# Altium schematic sheet Sheet4.SchDoc
size A4
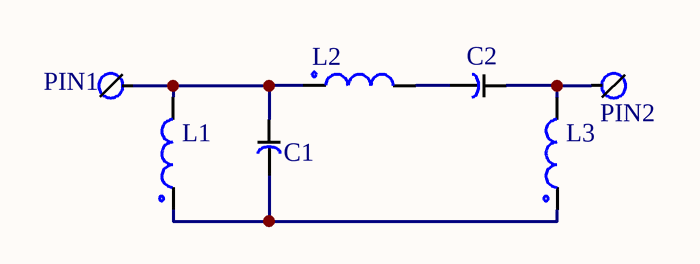
[diagram p0: Sheet4.SchDoc]

## Parts
C1  C1,C3  [C1,C3]  (value not drawn)
C2  C2  [C2]  (value not drawn)
L1  L1,L2,L3  [L1,L2,L3]  (value not drawn)
L2  L1,L2,L3  [L1,L2,L3]  (value not drawn)
L3  L1,L2,L3  [L1,L2,L3]  (value not drawn)
PIN1  PIN  [PIN]  (value not drawn)
PIN2  PIN  [PIN]  (value not drawn)

## Nets
NetC1_1: C1.1 L1.1 L3.1
NetC1_2: C1.2 L1.2 L2.1 PIN1.1
NetC2_1: C2.1 L2.2
NetC2_2: C2.2 L3.2 PIN2.1